# EAGLE design driver (EAGLE 7.7.0)
Driver de Motor para Arduchallenge 2017 Guatemala
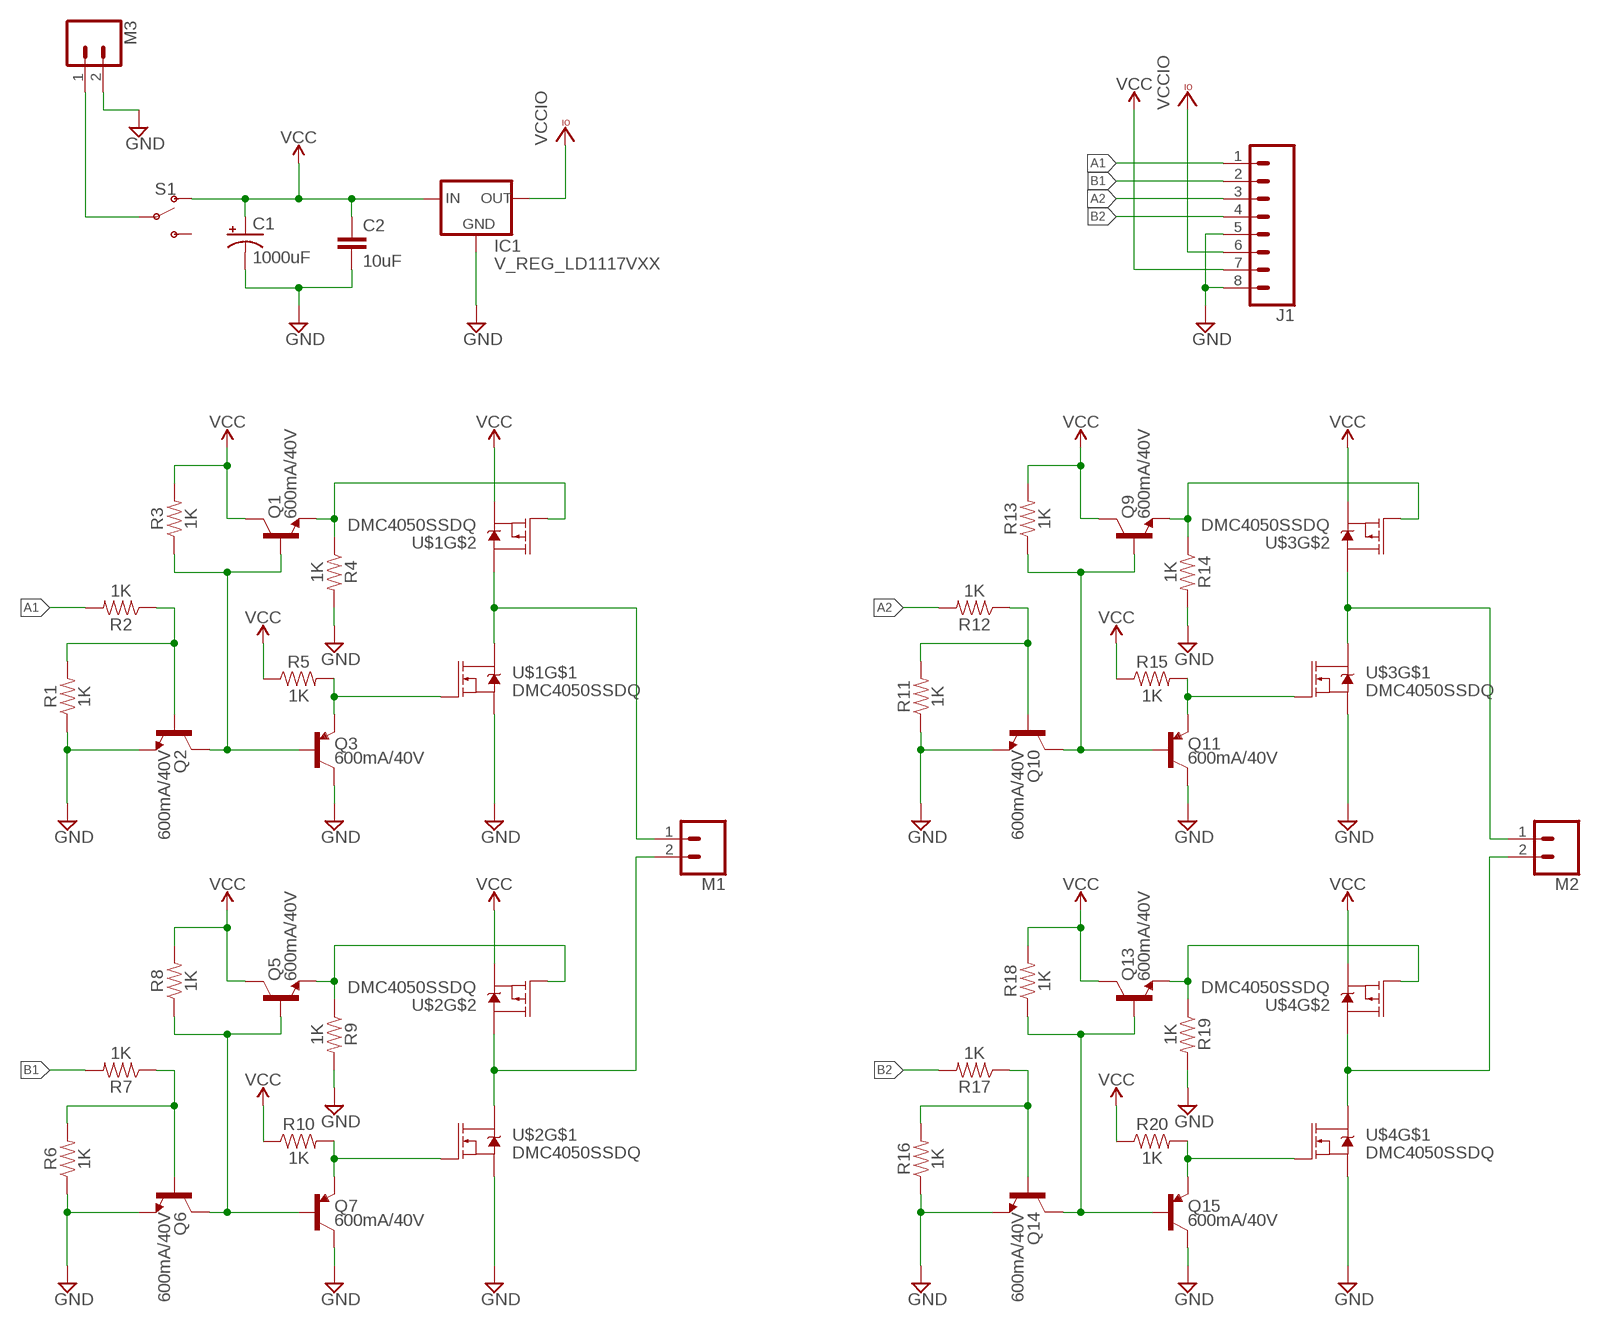
[diagram p0: schematic, sheet 1]

## Parts
C1  1000uF  1000UF-RADIAL-5MM-25V-20%  [CPOL-RADIAL-5MM-10MM]
C2  10uF  1.0UF-0805-25V-10%  [0805]
IC1  V_REG_LD1117VXX  [78XXL]
J1  CONN_08"  [1X08]
M1  CONN_023.5MM  [SCREWTERMINAL-3.5MM-2]
M2  CONN_023.5MM  [SCREWTERMINAL-3.5MM-2]
M3  CONN_023.5MM  [SCREWTERMINAL-3.5MM-2]
Q1  600mA/40V  TRANS_NPN-MMBT2222AL  [SOT23-3]
Q2  600mA/40V  TRANS_NPN-MMBT2222AL  [SOT23-3]
Q3  600mA/40V  TRANS_PNP-MMBT4403  [SOT23-3]
Q5  600mA/40V  TRANS_NPN-MMBT2222AL  [SOT23-3]
Q6  600mA/40V  TRANS_NPN-MMBT2222AL  [SOT23-3]
Q7  600mA/40V  TRANS_PNP-MMBT4403  [SOT23-3]
Q9  600mA/40V  TRANS_NPN-MMBT2222AL  [SOT23-3]
Q10  600mA/40V  TRANS_NPN-MMBT2222AL  [SOT23-3]
Q11  600mA/40V  TRANS_PNP-MMBT4403  [SOT23-3]
Q13  600mA/40V  TRANS_NPN-MMBT2222AL  [SOT23-3]
Q14  600mA/40V  TRANS_NPN-MMBT2222AL  [SOT23-3]
Q15  600mA/40V  TRANS_PNP-MMBT4403  [SOT23-3]
R1  1K  RESISTOR0805  [0805]
R2  1K  RESISTOR0805  [0805]
R3  1K  RESISTOR0805  [0805]
R4  1K  RESISTOR0805  [0805]
R5  1K  RESISTOR0805  [0805]
R6  1K  RESISTOR0805  [0805]
R7  1K  RESISTOR0805  [0805]
R8  1K  RESISTOR0805  [0805]
R9  1K  RESISTOR0805  [0805]
R10  1K  RESISTOR0805  [0805]
R11  1K  RESISTOR0805  [0805]
R12  1K  RESISTOR0805  [0805]
R13  1K  RESISTOR0805  [0805]
R14  1K  RESISTOR0805  [0805]
R15  1K  RESISTOR0805  [0805]
R16  1K  RESISTOR0805  [0805]
R17  1K  RESISTOR0805  [0805]
R18  1K  RESISTOR0805  [0805]
R19  1K  RESISTOR0805  [0805]
R20  1K  RESISTOR0805  [0805]
S1  SWITCH-SPDT-PTH-11.6X4.0MM  [SWITCH_SPDT_PTH_11.6X4.0MM]
U$1  DMC4050SSDQ  [SO08]
U$2  DMC4050SSDQ  [SO08]
U$3  DMC4050SSDQ  [SO08]
U$4  DMC4050SSDQ  [SO08]

## Nets
A1: J1.1 R2.2
A2: J1.3 R12.2
B1: J1.2 R7.2
B2: J1.4 R17.2
GND: C1.- C2.2 IC1.IN(GND) J1.5 J1.8 M3.2 Q2.2(E) Q3.3(C) Q6.2(E) Q7.3(C) Q10.2(E) Q11.3(C) Q14.2(E) Q15.3(C) R1.1 R4.2 R6.1 R9.2 R11.1 R14.2 R16.1 R19.2 U$1.1(S) U$2.1(S) U$3.1(S) U$4.1(S)
M1B: M1.2 U$2.5(D) U$2.6(D) U$2.7(D) U$2.8(D)
M1T: M1.1 U$1.5(D) U$1.6(D) U$1.7(D) U$1.8(D)
M2B: M2.2 U$4.5(D) U$4.6(D) U$4.7(D) U$4.8(D)
M2T: M2.1 U$3.5(D) U$3.6(D) U$3.7(D) U$3.8(D)
N$1: Q2.1(B) R1.2 R2.1
N$2: Q1.1(B) Q2.3(C) Q3.1(B) R3.1
N$3: Q3.2(E) R5.2 U$1.2(G)
N$4: Q6.1(B) R6.2 R7.1
N$5: Q5.1(B) Q6.3(C) Q7.1(B) R8.1
N$6: Q7.2(E) R10.2 U$2.2(G)
N$7: Q1.2(E) R4.1 U$1.4(G)
N$8: Q10.1(B) R11.2 R12.1
N$9: Q9.1(B) Q10.3(C) Q11.1(B) R13.1
N$10: Q5.2(E) R9.1 U$2.4(G)
N$11: Q11.2(E) R15.2 U$3.2(G)
N$12: Q9.2(E) R14.1 U$3.4(G)
N$13: Q14.1(B) R16.2 R17.1
N$14: Q13.1(B) Q14.3(C) Q15.1(B) R18.1
N$15: Q15.2(E) R20.2 U$4.2(G)
N$16: Q13.2(E) R19.1 U$4.4(G)
N$18: M3.1 S1.2(P)
VCC: C1.+ C2.1 IC1.OUT(IN) J1.7 Q1.3(C) Q5.3(C) Q9.3(C) Q13.3(C) R3.2 R5.1 R8.2 R10.1 R13.2 R15.1 R18.2 R20.1 S1.1(O) U$1.3(S) U$2.3(S) U$3.3(S) U$4.3(S)
VCCIO: IC1.GND(OUT) J1.6
Unconnected: S1.3(S)

## Library data of the parts
C1 = SparkFun-Capacitors:1000UF: 1,000µF/1mF ceramic capacitors A capacitor is a passive two-terminal electrical component used to store electrical energy temporarily in an electric field. CAP-08070; PROD_ID: CAP-09538; VALUE: 1mF
C2 = SparkFun-Capacitors:1.0UF: 1µF ceramic capacitors A capacitor is a passive two-terminal electrical component used to store electrical energy temporarily in an electric field.; PROD_ID: CAP-08064; VALUE: 1.0uF
IC1 = SparkFun-IC-Power:V_REG_LD1117VXX: LD1117VXX voltage regulator. We carry the 3.3V version (COM-00526) in TO-220 package.
J1 = SparkFun-Connectors:CONN_08: Multi connection point. Often used as Generic Header-pin footprint for 0.1 inch spaced/style header connections On any of the 0.1 inch spaced packages, you can populate with these: Break Away Headers - Straight <https://www.sparkfun.com/products/116> (PRT-00116) Break Away Male Headers - Right Angle <https://www.sparkfun.com/products/553> (PRT-00553) Female Headers <https://www.sparkfun.com/products/115> (PRT-00115) Break Away Headers - Machine Pin <https://www.sparkfun.com/products/117> (PRT-00117) Break Away Female Headers - Swiss Machine Pin <https://www.sparkfun.com/products/743> (PRT-00743) Arduino Stackable Header - 8 Pin <https://www.sparkfun.com/products/9279> (PRT-09279) For SCREWTERMINALS and SPRING TERMINALS visit here: Screw Terimnals on SparkFun.com <https://www.sparkfun.com/search/results?term=Screw+Terminals> (5mm/3.5mm/2.54mm spacing) This device is also useful as a general connection point to wire up your design to another part of your project. Our various solder wires solder well into these plated through hole pads. Hook-Up Wire - Assortment (Stranded, 22 AWG) <https://www.sparkfun.com/products/11375> (PRT-11375) Hook-Up Wire - Assortment (Solid Core, 22 AWG) <https://www.sparkfun.com/products/11367> (PRT-11367) View the entire wire category on our website here <https://www.sparkfun.com/categories/141> Special notes: Molex polarized connector foot print use with SKU : PRT-08231 with associated crimp pins and housings. 1MM SMD Version SKU: PRT-10208 NOTES ON THE VARIANTS LOCK and LOCK_LONGPADS... This footprint was designed to help hold the alignment of a through-hole component (i.e. 6-pin header) while soldering it into place. You may notice that each hole has been shifted either up or down by 0.005 of an inch from it's more standard position (which is a perfectly straight line). This slight alteration caused the pins (the squares in the middle) to touch the edges of the holes. Because they are alternating, it causes a "brace" to hold the component in place. 0.005 has proven to be the perfect amount of "off-center" position when using our standard breakaway headers. Although looks a little odd when you look at the bare footprint, once you have a header in there, the alteration is very hard to notice. Also,if you push a header all the way into place, it is covered up entirely on the bottom side.; PROD_ID: CONN-08438
M1-M3 = SparkFun-Connectors:CONN_02: Multi connection point. Often used as Generic Header-pin footprint for 0.1 inch spaced/style header connections On any of the 0.1 inch spaced packages, you can populate with these: Break Away Headers - Straight <https://www.sparkfun.com/products/116> (PRT-00116) Break Away Male Headers - Right Angle <https://www.sparkfun.com/products/553> (PRT-00553) Female Headers <https://www.sparkfun.com/products/115> (PRT-00115) Break Away Headers - Machine Pin <https://www.sparkfun.com/products/117> (PRT-00117) Break Away Female Headers - Swiss Machine Pin <https://www.sparkfun.com/products/743> (PRT-00743) For SCREWTERMINALS and SPRING TERMINALS visit here: Screw Terimnals on SparkFun.com <https://www.sparkfun.com/search/results?term=Screw+Terminals> (5mm/3.5mm/2.54mm spacing) This device is also useful as a general connection point to wire up your design to another part of your project. Our various solder wires solder well into these plated through hole pads. Hook-Up Wire - Assortment (Stranded, 22 AWG) <https://www.sparkfun.com/products/11375> (PRT-11375) Hook-Up Wire - Assortment (Solid Core, 22 AWG) <https://www.sparkfun.com/products/11367> (PRT-11367) View the entire wire category on our website here <https://www.sparkfun.com/categories/141> Special notes: Molex polarized connector foot print use with: PRT-08233 with associated crimp pins and housings. 2.54_SCREWTERM for use with PRT-10571. 3.5mm Screw Terminal footprints for PRT-08084 5mm Screw Terminal footprints for use with PRT-08432; PROD_ID: CONN-08399
Q1 Q2 Q5 Q6 Q9 Q10 Q13 Q14 = SparkFun-DiscreteSemi:TRANS_NPN: NPN transistor Current controlled devices typically used to amplify current or used as a switch. BC547 - COM-08928 <http://www.sparkfun.com/products/8928> (TO-92 45V 100mA) (1.Collector 2.Base 3.Emitter) 2N3904 - COM-00521 <http://www.sparkfun.com/products/521> (TO-92 40V 200mA) (1.Emitter 2.Base 3.Collector) P2N2222A - COM-12852 <http://www.sparkfun.com/products/12852> (TO-92 40V 600mA) (1.Collector 2.Base 3.Emitter); PROD_ID: TRANS-08049
Q3 Q7 Q11 Q15 = SparkFun-DiscreteSemi:TRANS_PNP: PNP transistor Current controlled devices typically used to amplify current or used as a switch. SparkFun Products: SparkFun Serial Enabled 16x2 LCD - Red on Black <https://www.sparkfun.com/products/9068> SparkFun Logomatic <https://www.sparkfun.com/products/12772>; PROD_ID: TRANS-09245
R1-R20 = SparkFun-Resistors:RESISTOR: Generic Resistor Package
S1 = SparkFun-Switches:SWITCH-SPDT: Single Pole, Double Throw (SPDT) Switch Single-pole, double-throw (SPDT) switch. Variant Overview SMD-AYZ0202 Surface Mount DPDT Switch <https://www.sparkfun.com/products/597> (COM-00597) Used on e.g. LilyPad Arduino USB - ATmega32U4 Board <https://www.sparkfun.com/products/12049> PTH-11.6X4.0MM SPDT Mini Power Switch <https://www.sparkfun.com/products/102> (COM-00102) Used on e.g. SparkFun Simon Says - Through-Hole Soldering Kit <https://www.sparkfun.com/products/10547> (KIT-10547) PTH-11.6X4.0MM-KIT KIT version of SPDT Mini Power Switch - Simplifies soldering by removing tStop of switch pins - only one side can be soldered. PTH-11.6X4.0MM-LOCK LOCK version of SPDT Mini Power Switch - Offset pins hold switch in place for easier soldering. SMD-RIGHT-ANGLE Surface Mount Right Angle Switch <https://www.sparkfun.com/products/10860> (COM-10860) Used on e.g. SparkFun ESP8266 Thing <https://www.sparkfun.com/products/13231>; PROD_ID: SWCH-08261; SF_SKU: COM-00102
U$1-U$4 = SeguidorLineasLbr:DMC4050SSDQ

## Board
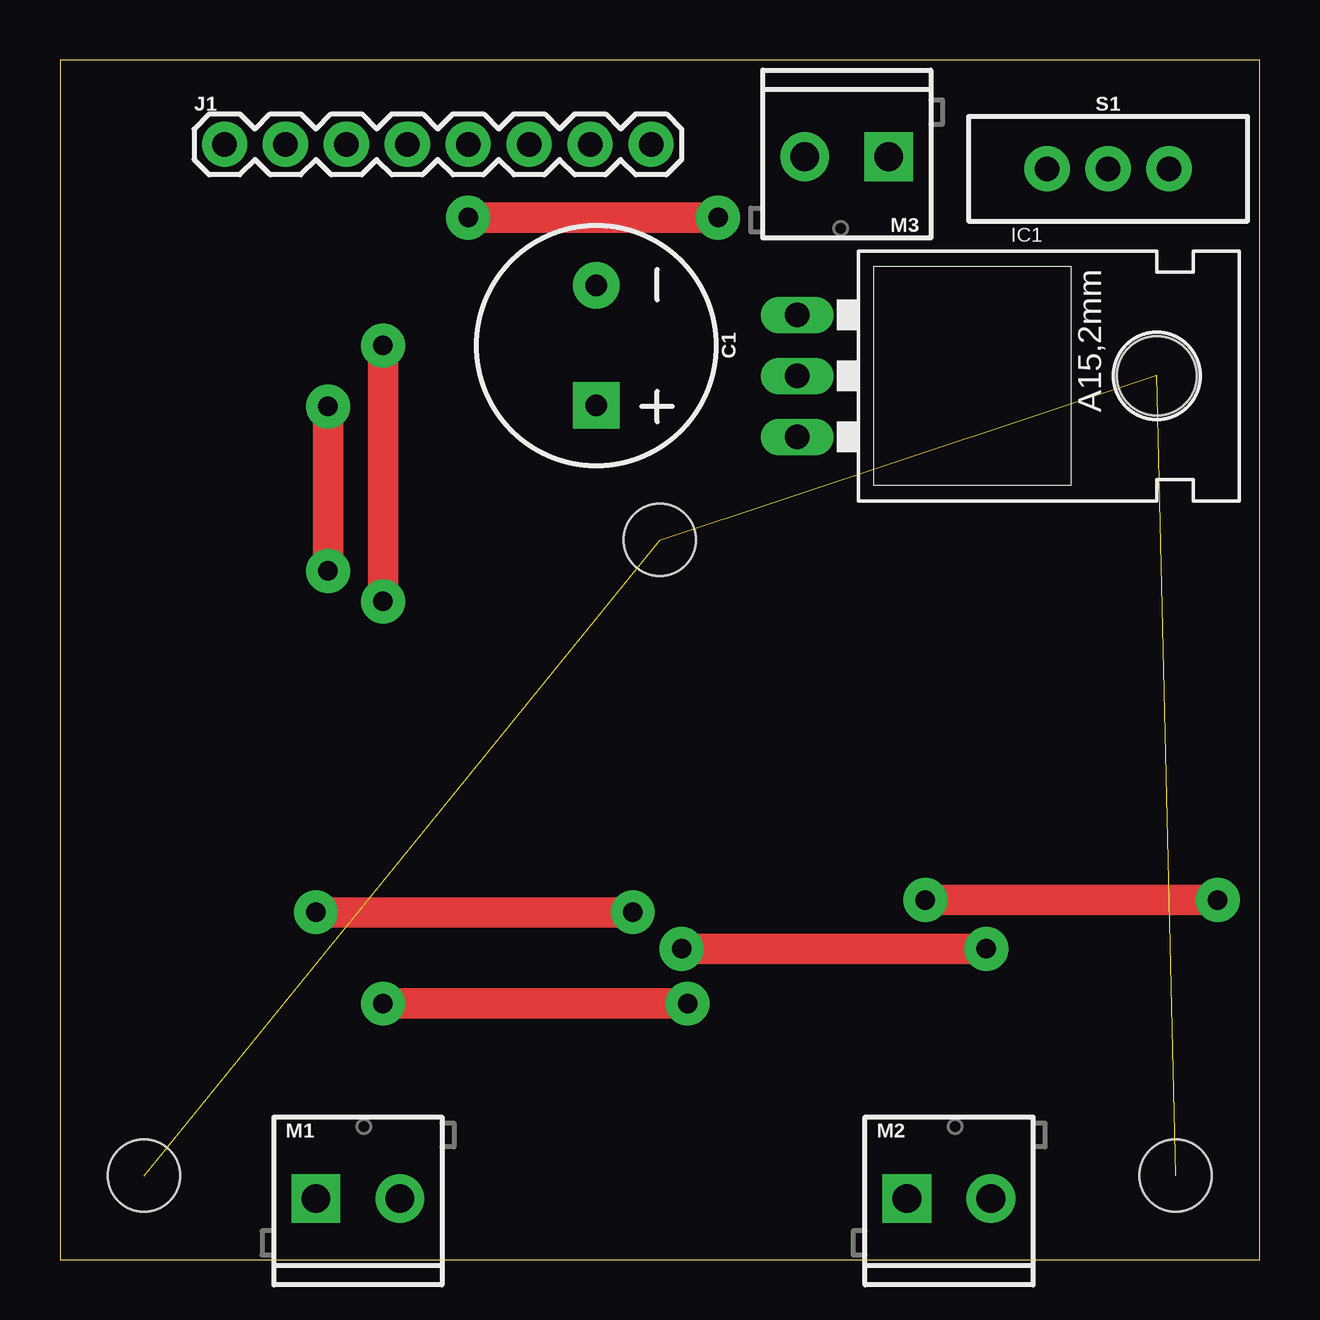
[diagram p1: board, top side]
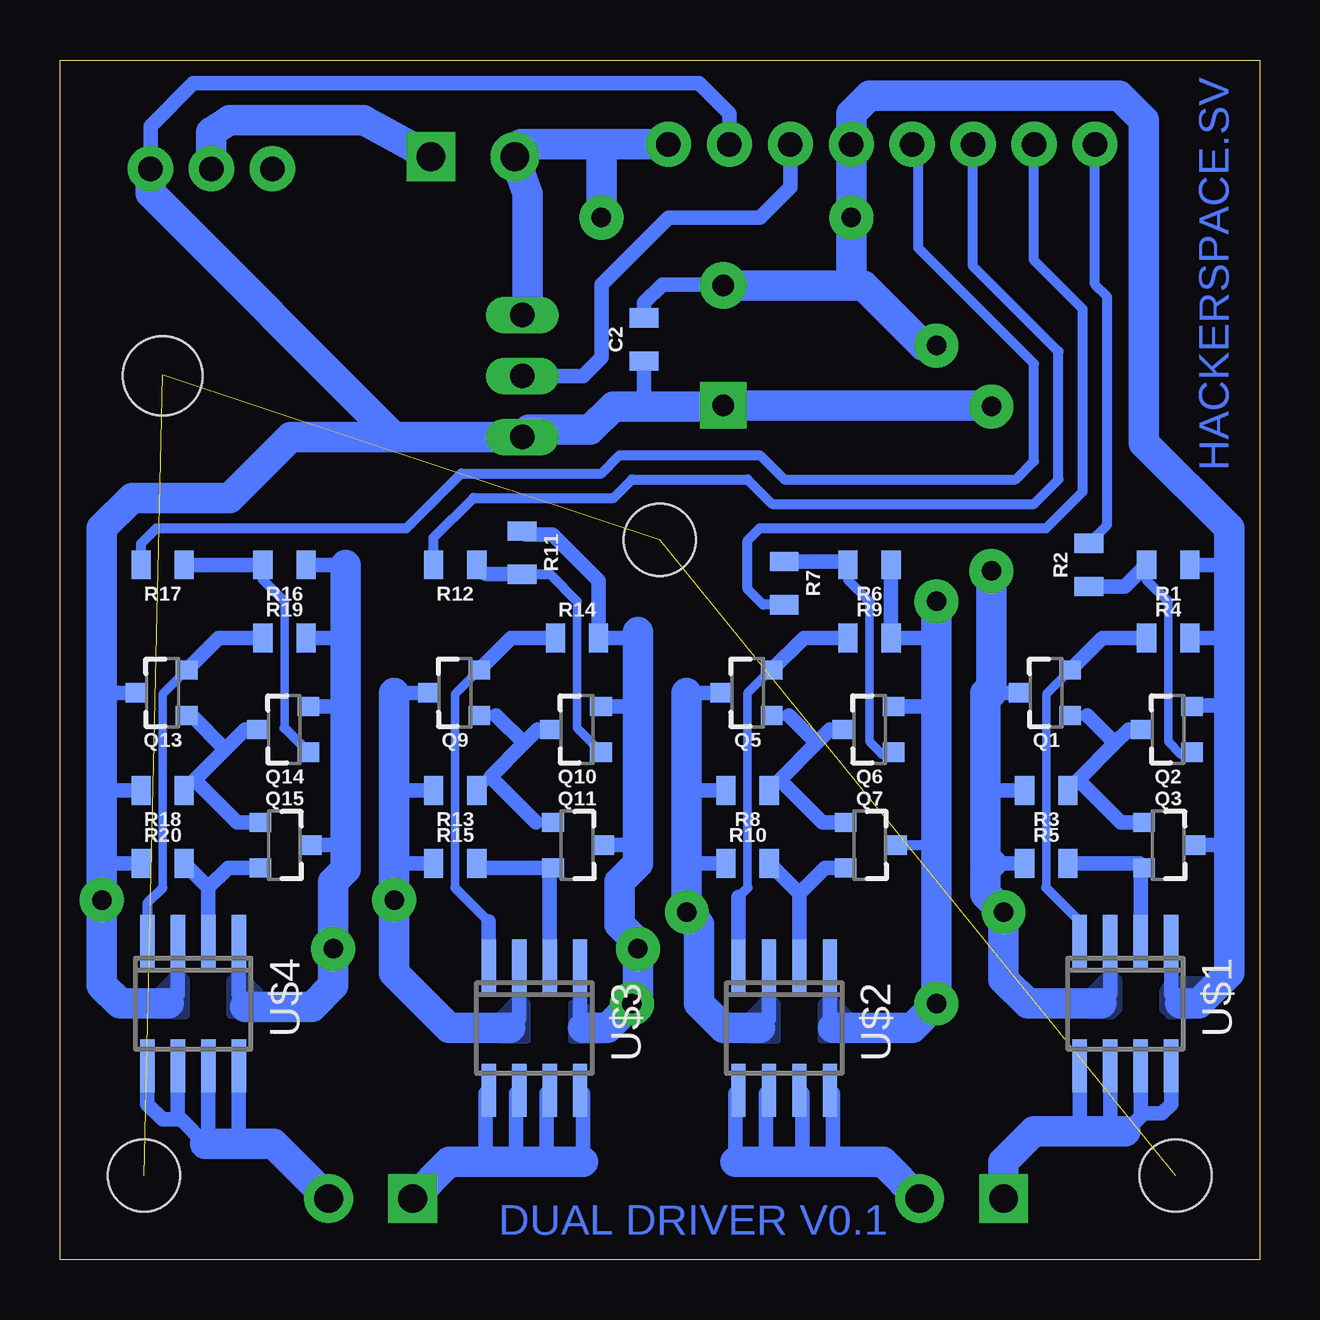
[diagram p2: board, bottom side, seen from below]

Size 50 x 50 mm. Coordinates in mm from the lower left corner, seen from the top.
Outline: 0,0 50,0 50,50 0,50 0,0
Copper layers (1*16): Top 0.035mm / dielectric 1.5mm / Bottom 0.035mm
Design rules "default *": minimum track width 10mil, minimum drill 24mil, track to track 8mil, track to pad 8mil, pad to pad 8mil, via to via 8mil, smd to smd 8mil, copper to edge 40mil, drill to drill 8mil, minimum pad ring 10mil, minimum via ring 20mil, stop-mask expansion 4mil, vias tented up to drill 0mil, thermal gap 10mil
Holes 3 mm at 3.5,3.5 46.5,3.5 25,30

### Footprints (pad centres in the part's own frame; a part is rotated, then mirrored left to right if it is on the bottom)
CPOL-RADIAL-5MM-10MM = drill 0.9 pad 1.93 square: + 2.5,0 | drill 0.9 pad 1.93: - -2.5,0
0805 = smd 0.8 x 1.2: 1 -0.9,0; 2 0.9,0
78XXL = drill 1.016 long: GND 0,-3.81; IN -2.54,-3.81; OUT 2.54,-3.81 | hole 3.302: 0,11.176
1X08 = drill 1.016 pad 1.88: 1 0,0; 2 2.54,0; 3 5.08,0; 4 7.62,0; 5 10.16,0; 6 12.7,0; 7 15.24,0; 8 17.78,0
SCREWTERMINAL-3.5MM-2 = drill 1.2 pad 2.032 square: 1 0,0 | drill 1.2 pad 2.032: 2 3.5,0
SOT23-3 = smd 0.8 x 0.9: 1 -0.95,-1; 2 0.95,-1; 3 0,1.1
SWITCH_SPDT_PTH_11.6X4.0MM = drill 1.016 pad 1.88: 1 0,2.54; 2 0,0; 3 0,-2.54
SO08 = smd 0.6 x 2.2: 1 -1.905,-2.6; 2 -0.635,-2.6; 3 0.635,-2.6; 4 1.905,-2.6; 5 1.905,2.6; 6 0.635,2.6; 7 -0.635,2.6; 8 -1.905,2.6

### Placement (x,y rotation side)
C1  22.35,38.1 270 top
C2  25.65,38.35 90 bottom
IC1  34.54,36.83 270 top
J1  6.86,46.48 0 top
M1  10.67,2.54 0 top
M2  35.31,2.54 0 top
M3  34.54,45.97 180 top
Q1  8.89,23.62 90 bottom
Q2  3.81,22.1 90 bottom
Q3  3.81,17.27 270 bottom
Q5  21.34,23.62 90 bottom
Q6  16.26,22.1 90 bottom
Q7  16.26,17.27 270 bottom
Q9  33.53,23.62 90 bottom
Q10  28.45,22.1 90 bottom
Q11  28.45,17.27 270 bottom
Q13  45.72,23.62 90 bottom
Q14  40.64,22.1 90 bottom
Q15  40.64,17.27 270 bottom
R1  3.81,28.96 180 bottom
R2  7.11,28.96 90 bottom
R3  8.89,19.56 180 bottom
R4  3.81,25.91 0 bottom
R5  8.89,16.51 0 bottom
R6  16.26,28.96 180 bottom
R7  19.81,28.19 270 bottom
R8  21.34,19.56 180 bottom
R9  16.26,25.91 0 bottom
R10  21.34,16.51 0 bottom
R11  30.73,29.46 270 bottom
R12  33.53,28.96 180 bottom
R13  33.53,19.56 180 bottom
R14  28.45,25.91 0 bottom
R15  33.53,16.51 0 bottom
R16  40.64,28.96 180 bottom
R17  45.72,28.96 180 bottom
R18  45.72,19.56 180 bottom
R19  40.64,25.91 0 bottom
R20  45.72,16.51 0 bottom
S1  43.69,45.47 270 top
U$1  5.59,10.67 180 bottom
U$2  19.81,9.65 180 bottom
U$3  30.23,9.65 180 bottom
U$4  44.45,10.67 180 bottom

### Tracks (layer width: path | path; a pad name or v marks a point on that pad's centre or on a via)
A1
  Bottom 0.406: 7.11,46.23 J1.1 6.86,40.64 6.35,40.13 6.35,30.62 R2.2
A2
  Bottom 0.406: R12.2 34.43,30.09 32.77,31.75 26.92,31.75 26.16,32.51 21.34,32.51 20.32,31.5 9.4,31.5 8.38,32.51 8.38,37.85 11.94,41.4 J1.3
B1
  Bottom 0.406: J1.2 9.4,41.66 7.37,39.62 7.37,32 8.89,30.48 20.83,30.48 21.34,29.97 21.34,27.94 20.69,27.29 R7.2
B2
  Bottom 0.406: R17.2 46.62,29.83 45.97,30.48 35.56,30.48 33.27,32.77 27.43,32.77 26.67,33.53 20.83,33.53 19.81,32.51 10.16,32.51 9.4,33.27 9.4,37.34 14.22,42.16 14.22,46.23 J1.4
GND  (via drill 0.81)
  Top 1.27: v13.46,38.1 v13.46,27.43 | v26.16,10.67 v13.46,10.67 | v27.43,43.43 v17.02,43.43 | v25.91,12.95 v38.61,12.95
  Bottom 0.406: Q2.2 2.81,23.1 2.79,23.11 | 1.29,23.1 1.27,23.11 | 13.53,23.05 13.46,23.11 | Q7.3 13.46,17.27 | 26.16,25.91 25.91,26.16 | 26.1,23.05 25.91,22.86 | 38.17,23.05 38.1,23.11 | 30.6,30.23 R11.1 | 3.68,11.05 3.3,10.67 | 42.55,11.05 42.29,10.54 42.16,10.67
  Bottom 0.61: Q3.3 1.27,17.27 | 2.81,23.1 1.29,23.1 | R4.2 1.27,25.91 | 13.46,25.91 R9.2 R6.1 | Q6.2 13.53,23.05 | 26.16,25.91 R14.2 27.55,28.31 29.46,30.23 30.6,30.23 | Q10.2 26.1,23.05 | Q11.3 25.91,17.27 | R16.1 38.1,28.96 | R19.2 38.1,25.91 | Q14.2 38.17,23.05 | Q15.3 38.1,17.27 | R1.1 1.27,28.96 | U$2.1 17.91,9.78 17.78,9.65 | U$3.1 28.32,9.78 28.19,9.65 | C2.2 25.65,39.88 24.89,40.64 22.9,40.64 C1.- | U$1.1 3.68,11.05 | U$4.1 42.55,11.05
  Bottom 1.27: 25.91,26.16 25.91,22.86 25.91,17.27 25.91,16.51 26.67,15.75 26.67,13.97 25.91,13.21 v25.91,12.95 25.91,10.92 v26.16,10.67 27.18,9.65 28.19,9.65 | 38.1,28.96 38.1,25.91 38.1,23.11 38.1,17.27 38.1,16.26 38.61,15.75 v38.61,12.95 38.61,11.43 39.5,10.54 42.29,10.54 | IC1.IN 30.52,39.58 30.52,44.43 M3.2 30.79,46.48 27.43,46.48 | v13.46,27.43 13.46,25.91 13.46,23.11 13.46,17.27 v13.46,10.67 14.48,9.65 17.78,9.65 | J1.8 27.43,46.48 | 3.3,10.67 2.54,10.67 1.27,11.94 1.27,17.27 1.27,23.11 1.27,25.91 1.27,28.96 1.27,30.48 4.83,34.04 4.83,47.5 5.84,48.51 16.26,48.51 17.02,47.75 J1.5 v17.02,43.43 17.02,40.6 | C1.- 17.02,40.6 | 17.02,40.6 16.51,40.6 14.01,38.1 v13.46,38.1 | v27.43,43.43 27.43,46.48
  pour Bottom: 2.03,11.68 3.81,11.68 4.06,11.18 4.06,10.41 3.81,10.16 2.79,10.16
  pour Bottom: 17.78,10.92 17.02,10.16 17.02,9.14 18.29,9.14 18.29,10.67 18.03,10.92
  pour Bottom: 27.43,10.16 27.69,10.16 28.19,10.67 28.7,10.67 28.7,9.14 27.43,9.14
  pour Bottom: 42.42,11.94 41.66,11.18 41.4,10.16 42.93,10.16 42.93,11.68 42.67,11.94
M1B
  Bottom 0.61: U$2.5 21.84,6.92 21.84,4.06 | U$2.6 20.57,6.92 20.57,4.06 | U$2.7 19.05,6.92 19.05,4.06 | U$2.8 17.78,6.92 17.78,4.06
  Bottom 1.27: M1.2 15.69,4.06 17.78,4.06 19.05,4.06 20.57,4.06 21.84,4.06
M1T
  Bottom 0.61: U$1.8 3.68,6.48 4.06,6.1 4.83,6.1 4.95,5.97 | 4.95,5.97 5.59,5.33 | U$1.7 4.95,5.97 | U$1.6 6.22,5.46 6.1,5.33 | U$1.5 7.49,5.46 7.62,5.33
  Bottom 1.27: M1.1 10.67,4.06 9.4,5.33 7.62,5.33 6.1,5.33 5.59,5.33
M2B
  Bottom 0.61: U$4.5 46.35,6.48 45.72,5.84 45.21,5.84 | 45.21,5.84 44.96,5.84 43.94,4.83 | U$4.6 45.09,5.97 45.21,5.84 | U$4.7 43.81,4.95 43.69,4.83 | U$4.8 42.55,4.95 42.42,4.83
  Bottom 1.27: M2.2 41.09,4.83 42.42,4.83 43.69,4.83 43.94,4.83
M2T
  Bottom 0.61: U$3.8 28.19,6.92 28.19,4.06 | U$3.7 29.72,6.92 29.72,4.06 | U$3.6 30.99,6.92 30.99,4.06 | U$3.5 32.26,6.92 32.26,4.06
  Bottom 1.27: M2.1 33.78,4.06 32.26,4.06 30.99,4.06 29.72,4.06 28.19,4.06
N$1
  Bottom 0.356: 3.81,27.43 3.81,21.59 3.3,21.08
  Bottom 0.406: R1.2 4.71,28.33 3.81,27.43 | 3.3,21.08 2.88,21.08 Q2.1
  Bottom 0.61: R1.2 5.61,28.06 R2.1
N$2
  Bottom 0.406: Q2.3 5.45,22.1 | 7.55,20 R3.1 | Q1.1 7.18,22.67
  Bottom 0.61: 5.45,22.1 6.03,21.52 | 6.03,21.52 7.55,20 5.78,18.22 Q3.1 | 7.18,22.67 6.03,21.52
N$3
  Bottom 0.406: 5,16.51 Q3.2
  Bottom 0.61: R5.2 5,16.51 | Q3.2 4.95,16.18 U$1.2
N$4
  Bottom 0.356: 16.26,27.43 16.26,21.59 15.75,21.08
  Bottom 0.406: 16.26,27.43 17.16,28.33 R6.2 17.29,29.09 | 15.75,21.08 15.32,21.08 Q6.1
  Bottom 0.61: 17.29,29.09 R7.1
N$5
  Bottom 0.406: Q6.3 17.9,22.1 | 20,20 R8.1 | Q5.1 19.62,22.67
  Bottom 0.61: 17.9,22.1 18.47,21.52 | 18.47,21.52 20,20 18.22,18.22 Q7.1 | 19.62,22.67 18.47,21.52
N$6
  Bottom 0.61: U$2.2 19.18,15.25 | 19.18,15.25 R10.2 | Q7.2 18.11,16.32 19.18,15.25
N$7
  Bottom 0.356: 8.89,15.49 8.89,23.57 Q1.2
  Bottom 0.406: 8.89,15.49 7.49,14.1 U$1.4
  Bottom 0.61: R4.1 6.55,25.91 Q1.2
N$8
  Bottom 0.356: Q10.1 28.45,22.15 28.45,27.43
  Bottom 0.406: R11.2 29.58,28.56 28.45,27.43 | 32.24,28.56 R12.1
  Bottom 0.61: R11.2 32.24,28.56
N$9
  Bottom 0.406: Q10.3 30.09,22.1 | 32.06,20.12 R13.1 | Q9.1 31.82,22.67 | Q11.1 30.16,18.22
  Bottom 0.61: 30.09,22.1 30.66,21.52 | 30.66,21.52 32.06,20.12 30.16,18.22 | 31.82,22.67 30.66,21.52
N$10
  Bottom 0.356: 20.39,24.57 21.34,23.62 21.34,15.49
  Bottom 0.406: Q5.2 20.39,24.57 | 21.34,15.49 21.72,15.11
  Bottom 0.61: R9.1 19,25.91 Q5.2 | 21.72,15.11 U$2.4
N$11
  Bottom 0.406: R15.2 32.44,16.32
  Bottom 0.61: 32.44,16.32 Q11.2 29.59,16.18 U$3.2
N$12
  Bottom 0.356: Q9.2 33.53,23.57 33.53,15.49
  Bottom 0.406: 33.53,15.49 32.13,14.1
  Bottom 0.61: R14.1 31.19,25.91 Q9.2 | 32.13,14.1 U$3.4
N$13
  Bottom 0.356: 40.64,27.43 40.64,22.15
  Bottom 0.406: R16.2 41.54,28.33 40.64,27.43 | 40.64,22.15 Q14.1
  Bottom 0.61: R16.2 R17.1
N$14
  Bottom 0.406: Q14.3 42.28,22.1 | 44.38,20 R18.1 | Q13.1 44.52,22.67
  Bottom 0.61: 42.28,22.1 43.11,21.27 | 43.11,21.27 44.38,20 42.61,18.22 Q15.1 | 44.52,22.67 43.11,21.27
N$15
  Bottom 0.61: 43.81,15.51 R20.2 | Q15.2 43,16.32 43.81,15.51 | 43.81,15.51 U$4.2
N$16
  Bottom 0.356: Q13.2 45.72,23.57 45.72,15.49
  Bottom 0.406: 45.72,15.49 46.35,14.86 U$4.4
  Bottom 0.61: R19.1 43.38,25.91 Q13.2
N$17  (via drill 0.79)  (3 unrouted)
  other vias: 3.5,3.5 46.5,3.5 25,30 45.72,36.86
N$18
  Bottom 1.27: S1.2 43.69,46.99 42.93,47.5 37.34,47.5 M3.1
VCC  (via drill 0.81)
  Top 1.27: v11.18,35.56 v11.18,28.7 | v23.88,14.48 v10.67,14.48 | v36.07,14.99 v48.26,14.99
  Bottom 0.406: 11.18,16.51 11.43,16.51 | 6.22,11.05 6.6,10.67 | 45.09,11.05 45.47,10.67
  Bottom 0.61: R5.1 11.18,16.51 | R3.2 11.43,19.56 | Q1.3 11.43,23.62 | Q5.3 23.88,23.62 | R8.2 23.88,19.56 | R10.1 23.88,16.51 | Q9.3 36.07,23.62 | R13.2 36.07,19.56 | R15.1 36.07,16.51 | Q13.3 48.26,23.62 | R18.2 48.26,19.56 | R20.1 48.26,16.51 | J1.7 22.1,47.75 23.37,49.02 44.45,49.02 46.23,47.24 S1.1 | U$2.3 20.45,10.03 20.83,9.65 | U$3.3 30.86,10.03 31.24,9.65 | C2.1 25.65,35.56 | U$1.3 6.22,11.05 | U$4.3 45.09,11.05
  Bottom 1.27: 11.43,16.51 11.43,19.56 11.43,23.62 11.18,23.62 v11.18,28.7 | 23.88,23.62 23.88,19.56 23.88,16.51 v23.88,14.48 23.37,13.97 23.37,10.67 22.35,9.65 20.83,9.65 | 36.07,23.62 36.07,19.56 36.07,16.51 v36.07,14.99 36.07,11.94 33.78,9.65 31.24,9.65 | 36.07,34.29 IC1.OUT 30.44,34.58 27.9,34.58 26.92,35.56 25.65,35.56 22.9,35.56 C1.+ 11.22,35.6 v11.18,35.56 | 36.07,34.29 40.39,34.29 42.93,31.75 46.99,31.75 48.26,30.48 48.26,23.62 48.26,19.56 48.26,16.51 v48.26,14.99 48.26,11.43 47.5,10.67 45.47,10.67 | S1.1 46.23,44.45 36.07,34.29 | 11.18,16.51 11.43,16.26 11.43,15.24 v10.67,14.48 10.67,11.68 9.65,10.67 6.6,10.67
  pour Bottom: 6.35,11.94 7.11,11.18 7.11,10.16 6.1,10.16 5.84,10.41 5.84,11.68 6.1,11.94
  pour Bottom: 20.57,10.92 21.34,10.16 21.34,9.14 20.07,9.14 20.07,10.67 20.32,10.92
  pour Bottom: 30.99,10.92 31.75,10.16 31.75,9.14 30.48,9.14 30.48,10.67 30.73,10.92
  pour Bottom: 45.21,11.94 45.97,11.18 45.97,10.16 44.7,10.16 44.7,11.43 44.7,11.68 44.96,11.94
VCCIO
  Bottom 0.61: 19.56,45.97 J1.6 19.56,44.7 20.83,43.43 24.64,43.43 27.43,40.64 27.43,37.59 28.19,36.83 IC1.GND

### Text on the board
Bottom: HACKERSPACE.SV | DUAL DRIVER V0.1